# Altium schematic sheet RS_485.SchDoc
size A; SheetNumber: 5; SheetTotal: 7
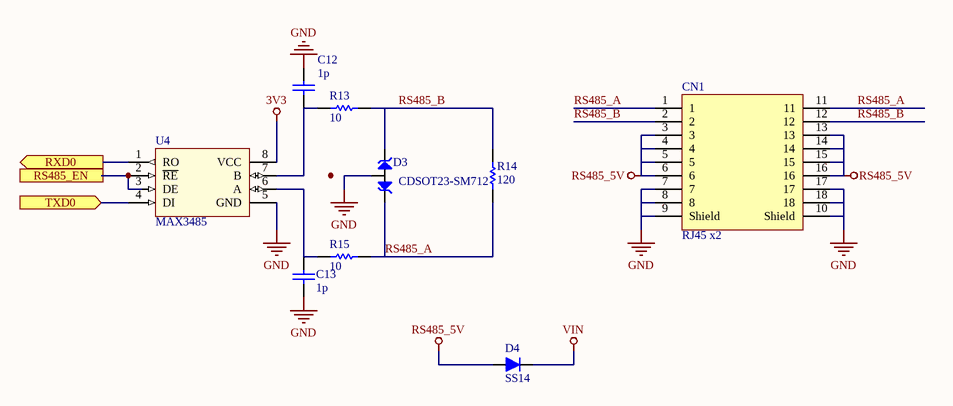
[diagram p0: RS_485.SchDoc]

## Parts
C12  value 1p  (hidden comment: Capacitor)
C13  value 1p  (hidden comment: Capacitor)
CN1  RJ45 x2  [CONN/RJ45/x2]
D3  CDSOT23-SM712  [SOT-23]
D4  SS14  [DO-35 (SOD27 )]
R13  value 10  (hidden comment: Resistor)
R14  value 120  (hidden comment: Resistor)
R15  value 10  (hidden comment: Resistor)
U4  MAX3485  [SOIC-8]

## Ports
RS485_EN (in, see ESP32_WROM_32[3B]), RXD0 (out, see ESP32_WROM_32[3B]), TXD0 (in, see ESP32_WROM_32[3B])

## Nets
3V3: U4.8(VCC)
GND: C12.2 C13.1 CN1.7 CN1.8 CN1.9(Shield) CN1.10(Shield) CN1.17 CN1.18 D3.3(COM) U4.5(GND)
RS485_5V: CN1.3 CN1.4 CN1.5 CN1.6 CN1.13 CN1.14 CN1.15 CN1.16 D4.1(A)
VIN: D4.2(K)
RS485_A: CN1.1 CN1.11 D3.1(IO1) R14.1 R15.2
RS485_B: CN1.2 CN1.12 D3.2(IO2) R13.2 R14.2
RS485_EN: U4.2(~{RE}) U4.3(DE) ; port RS485_EN
RXD0: U4.1(RO) ; port RXD0
TXD0: U4.4(DI) ; port TXD0
NetC12_1: C12.1 R13.1 U4.7(B)
NetC13_2: C13.2 R15.1 U4.6(A)

## Library data of the parts
C12 C13 = Capacitor: SimulationGenericComponent: True
CN1 = CON RJ45 x2: Connector RJ45 X2
D3 = CDSOT23-SM712: TVS DIODE 7V/12V 14V/26V SOT23-3
D4 = Diode: Default Diode
R13-R15 = Resistor: TC1: 0; SimulationGenericComponent: True; TC2: 0
U4 = MAX485: Low-Power, Slew-Rate-Limited  RS-485/RS-422 Transceivers